# EAGLE schematic adc_spi_esp12E (EAGLE 9.0.1)

## Sheet 1 of 2
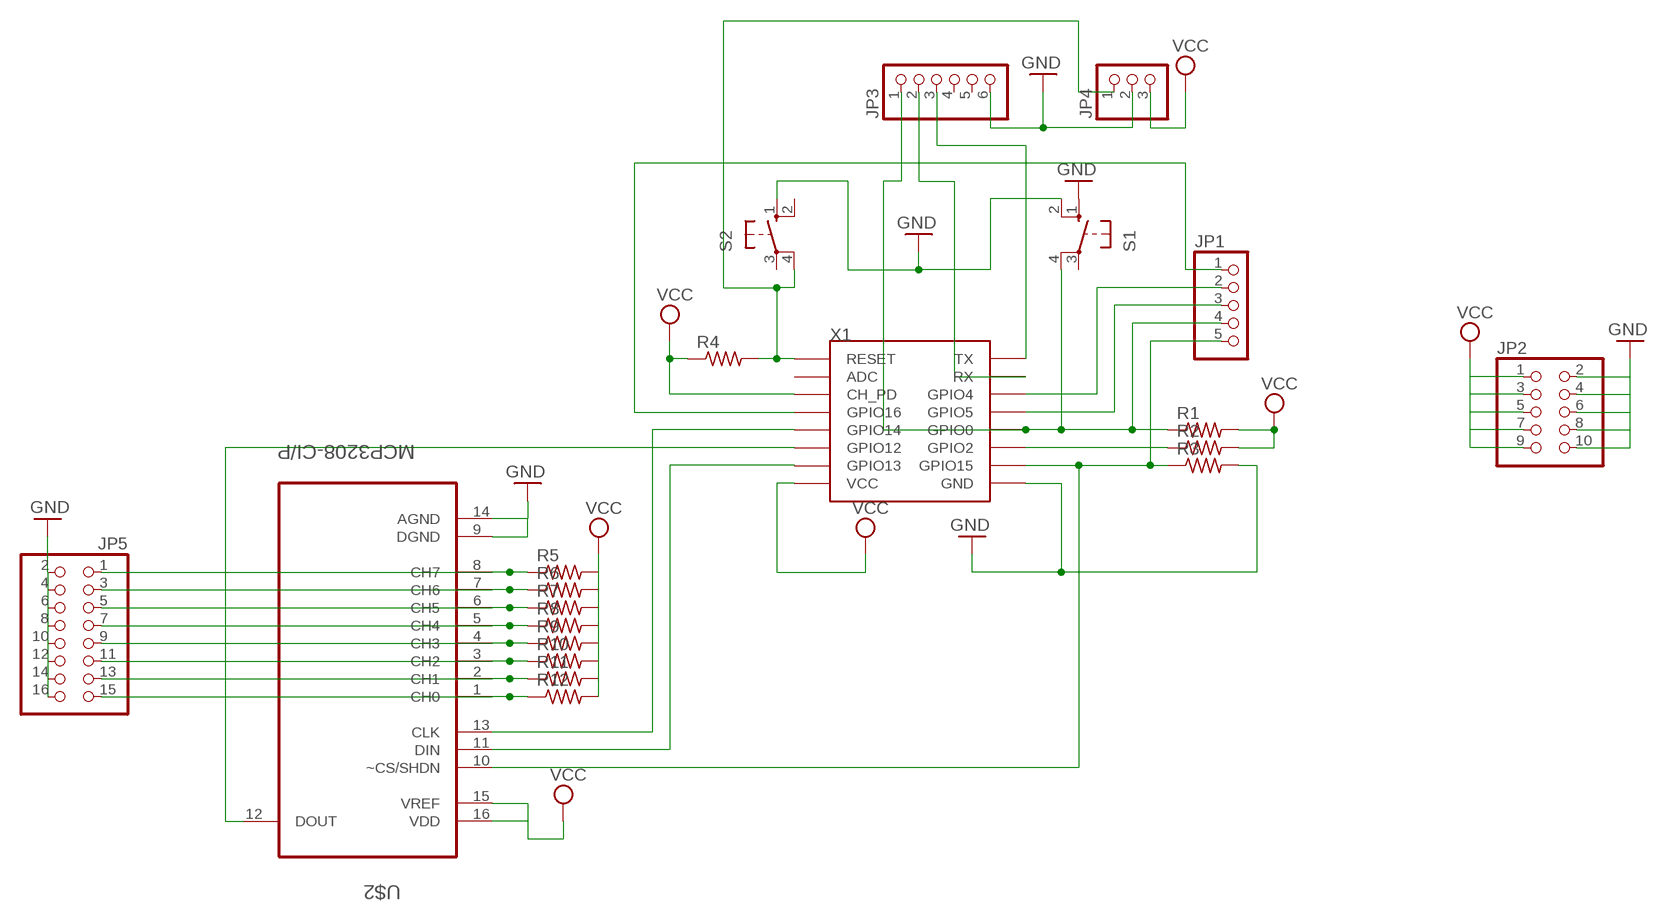
[diagram p0: schematic, sheet 1]

### Parts
JP1  PINHD-1X5  [1X05]
JP2  PINHD-2X5  [2X05]
JP3  PINHD-1X6B  [1X06-BIG]
JP4  PINHD-1X3  [1X03]
JP5  PINHD-2X8  [2X08]
R1  R-US_0204/7  [0204/7]
R2  R-US_0204/7  [0204/7]
R3  R-US_0204/7  [0204/7]
R4  R-US_0204/7  [0204/7]
R5  R-US_0204/7  [0204/7]
R6  R-US_0204/7  [0204/7]
R7  R-US_0204/7  [0204/7]
R8  R-US_0204/7  [0204/7]
R9  R-US_0204/7  [0204/7]
R10  R-US_0204/7  [0204/7]
R11  R-US_0204/7  [0204/7]
R12  R-US_0204/7  [0204/7]
S1  10-XX  [B3F-10XX]
S2  10-XX  [B3F-10XX]
U$2  MCP3208-CI/P  [DIP254P762X432-16]
X1  ESP12SMD  [ESP12-SMD]

### Nets
GND: JP2.2 JP2.4 JP2.6 JP2.8 JP2.10 JP3.6 JP4.2 JP5.2 JP5.4 JP5.6 JP5.8 JP5.10 JP5.12 JP5.14 JP5.16 R3.2 S1.1(S) S1.2(S1) S2.1(S) U$2.9(DGND) U$2.14(AGND) X1.GND
N$2: JP1.2 X1.GPIO4
N$3: R2.1 X1.GPIO2
N$4: JP1.1 X1.GPIO16
N$5: U$2.13(CLK) X1.GPIO14
N$6: U$2.11(DIN) X1.GPIO13
N$7: U$2.12(DOUT) X1.GPIO12
N$8: JP4.1 R4.2 S2.4(P1) X1.RESET
N$9: JP1.3 X1.GPIO5
N$10: JP1.4 JP3.1 R1.1 S1.4(P1) X1.GPIO0
N$11: JP3.3 X1.TXD0(TX)
N$12: JP1.5 R3.1 U$2.10(~CS/SHDN) X1.GPIO15
N$13: JP3.2 X1.RXD0(RX)
N$17: JP5.1 R5.1 U$2.8(CH7)
N$18: JP5.3 R6.1 U$2.7(CH6)
N$19: JP5.5 R7.1 U$2.6(CH5)
N$20: JP5.7 R8.1 U$2.5(CH4)
N$21: JP5.9 R9.1 U$2.4(CH3)
N$22: JP5.11 R10.1 U$2.3(CH2)
N$23: JP5.13 R11.1 U$2.2(CH1)
N$24: JP5.15 R12.1 U$2.1(CH0)
VCC: JP2.1 JP2.3 JP2.5 JP2.7 JP2.9 JP4.3 R1.2 R2.2 R4.1 R5.2 R6.2 R7.2 R8.2 R9.2 R10.2 R11.2 R12.2 U$2.15(VREF) U$2.16(VDD) X1.CH_PD X1.VCC
Unconnected: JP3.4 JP3.5 S1.3(P) S2.2(S1) S2.3(P) X1.ADC

## Sheet 2 of 2

## Library data of the parts
JP1 = pinhead:PINHD-1X5: PIN HEADER
JP2 = pinhead:PINHD-2X5: PIN HEADER
JP3 = adafruit:PINHD-1X6: PIN HEADER
JP4 = pinhead:PINHD-1X3: PIN HEADER
JP5 = pinhead:PINHD-2X8: PIN HEADER
R1-R12 = resistor:R-US_: RESISTOR, American symbol
S1 S2 = switch-omron:10-XX: OMRON SWITCH; MPN: B3F-1000; OC_FARNELL: 176432; OC_NEWARK: 36M3542
U$2 = MCP3208-CI_P:MCP3208-CI/P: A/D Converters; AVAILABILITY: Good; DESCRIPTION: 8 Channel SPI Serial Interface 2.7 V 12-Bit A/D Converter Through Hole - PDIP-16; MF: Microchip; MP: MCP3208-CI/P; PACKAGE: DIP-16 Microchip; PRICE: 3.21 USD
X1 = esp8266modules:ESP12: ESP8266 Wifi module 12

## Net classes
0 default: width 0.254 mm, clearance 0.254 mm